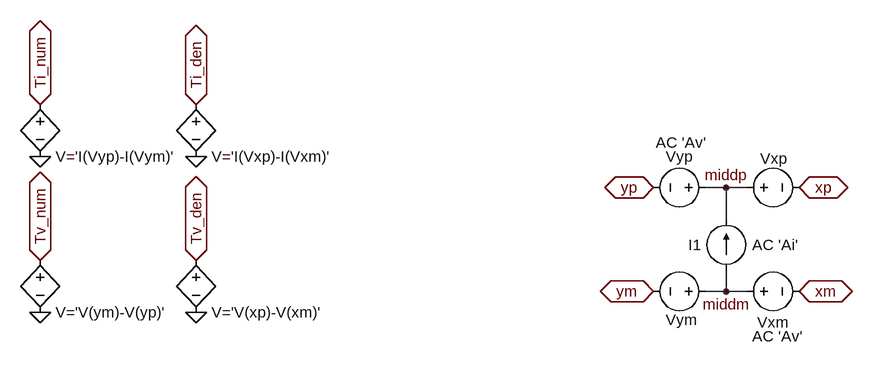
[diagram p0: schematic Diff_LoopTest.asc]
Diff_LoopTest.asc, the LTspice schematic file:
Version 4
SHEET 1 880 680
WIRE -240 80 -272 80
WIRE -208 80 -240 80
WIRE -240 128 -240 80
WIRE -240 240 -240 208
WIRE -240 240 -272 240
WIRE -208 240 -240 240
FLAG -352 80 yp
IOPIN -352 80 BiDir
FLAG -352 240 ym
IOPIN -352 240 BiDir
FLAG -128 80 xp
IOPIN -128 80 BiDir
FLAG -128 240 xm
IOPIN -128 240 BiDir
FLAG -240 80 middp
FLAG -240 240 middm
FLAG -1056 272 0
FLAG -1056 192 Tv_den
IOPIN -1056 192 BiDir
FLAG -1056 32 0
FLAG -1056 -48 Ti_den
IOPIN -1056 -48 BiDir
FLAG -1296 272 0
FLAG -1296 32 0
FLAG -1296 -48 Ti_num
IOPIN -1296 -48 BiDir
FLAG -1296 192 Tv_num
IOPIN -1296 192 BiDir
SYMBOL voltage -256 80 R90
WINDOW 0 -32 56 VBottom 2
WINDOW 3 32 56 VTop 2
WINDOW 123 -85 54 VTop 2
WINDOW 39 0 0 Left 2
SYMATTR InstName Vyp
SYMATTR Value ""
SYMATTR Value2 AC 'Av'
SYMBOL voltage -224 240 R270
WINDOW 0 -32 56 VBottom 2
WINDOW 3 32 56 VTop 2
WINDOW 123 -85 62 VTop 2
WINDOW 39 0 0 Left 2
SYMATTR InstName Vxm
SYMATTR Value ""
SYMATTR Value2 AC 'Av'
SYMBOL voltage -224 80 R270
WINDOW 0 60 57 VBottom 2
WINDOW 3 -60 56 Invisible 2
WINDOW 123 60 56 VTop 2
WINDOW 39 0 0 Left 2
SYMATTR InstName Vxp
SYMATTR Value 0
SYMBOL voltage -256 240 R90
WINDOW 0 59 53 VBottom 2
WINDOW 3 -4 56 Invisible 2
WINDOW 123 60 56 VTop 2
WINDOW 39 0 0 Left 2
SYMATTR InstName Vym
SYMATTR Value 0
SYMBOL current -240 208 R180
WINDOW 0 38 40 Left 2
WINDOW 3 24 0 Left 2
WINDOW 123 -110 40 Left 2
WINDOW 39 0 0 Left 2
SYMATTR InstName I1
SYMATTR Value ""
SYMATTR Value2 AC 'Ai'
SYMBOL bv -1056 176 R0
WINDOW 0 24 16 Invisible 2
SYMATTR InstName B1
SYMATTR Value V='V(xp)-V(xm)'
SYMBOL bv -1056 -64 R0
WINDOW 0 24 16 Invisible 2
SYMATTR InstName B2
SYMATTR Value V='I(Vxp)-I(Vxm)'
SYMBOL bv -1296 176 R0
WINDOW 0 24 16 Invisible 2
SYMATTR InstName B3
SYMATTR Value V='V(ym)-V(yp)'
SYMBOL bv -1296 -64 R0
WINDOW 0 24 16 Invisible 2
SYMATTR InstName B4
SYMATTR Value V='I(Vyp)-I(Vym)'

The netlist it stands for:
* Diff_LoopTest.asc
Vyp middp yp AC 'Av'
Vxm middm xm AC 'Av'
Vxp middp xp 0
Vym middm ym 0
I1 middm middp AC 'Ai'
B1 Tv_den 0 V='V(xp)-V(xm)'
B2 Ti_den 0 V='I(Vxp)-I(Vxm)'
B3 Tv_num 0 V='V(ym)-V(yp)'
B4 Ti_num 0 V='I(Vyp)-I(Vym)'
.backanno
.end